# Altium schematic sheet IC right.SchDoc
size A3
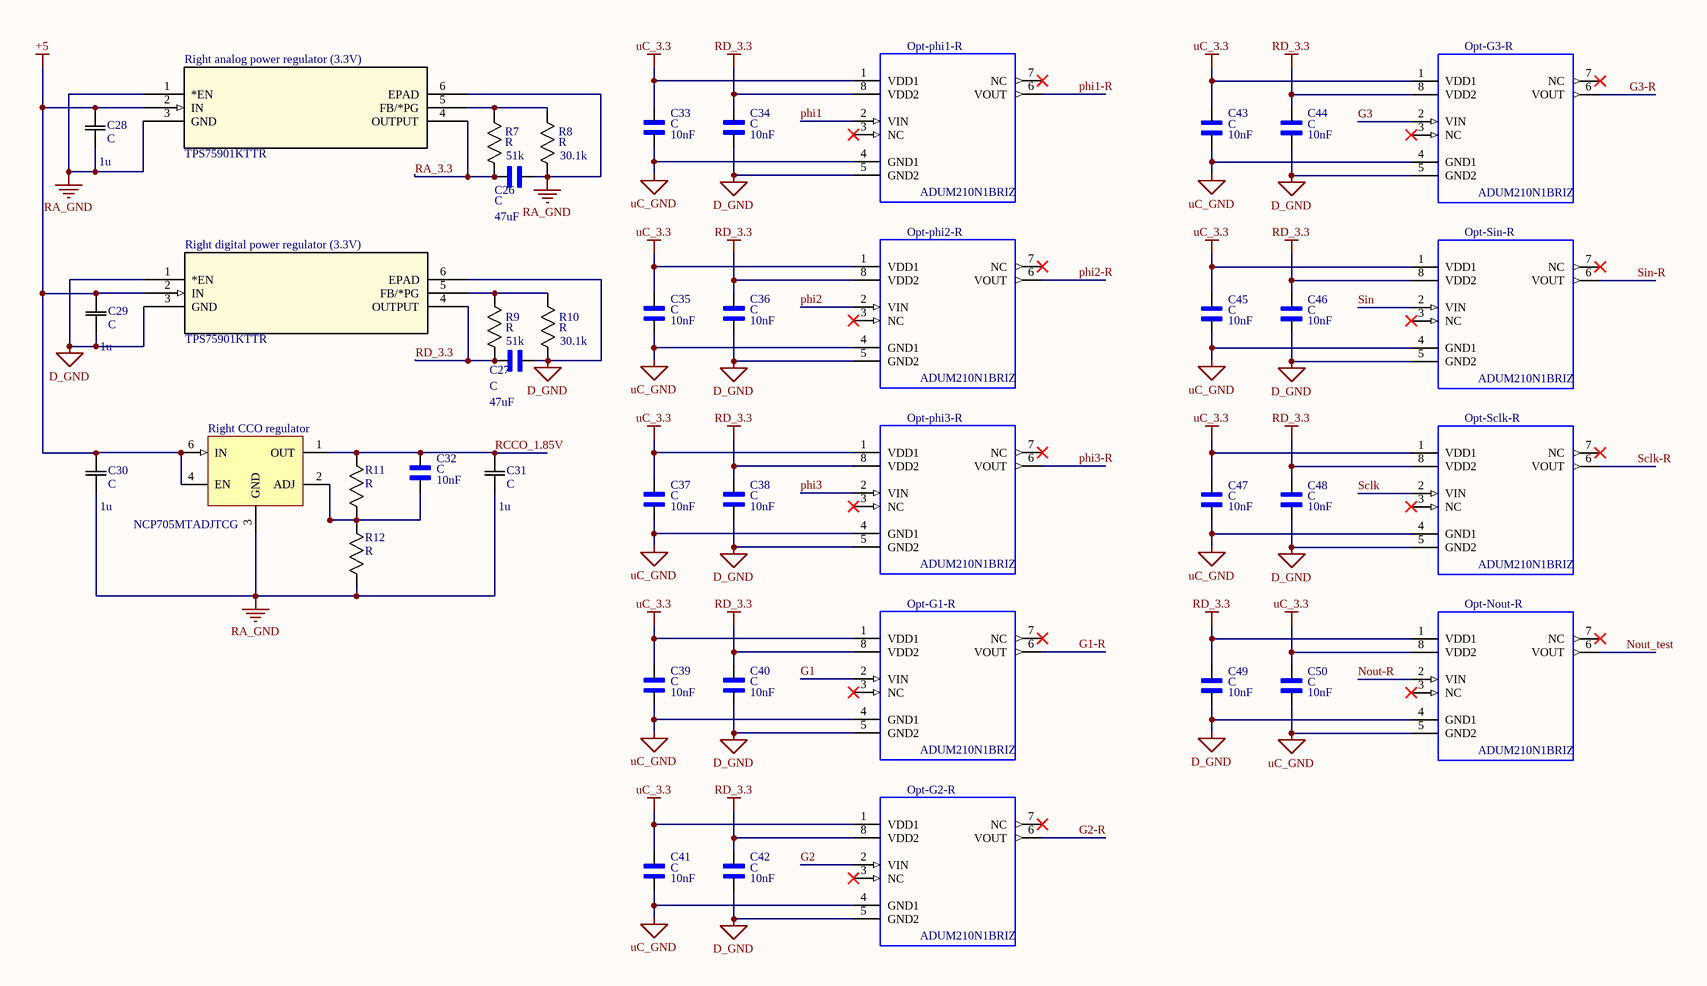
[diagram p0: IC right.SchDoc]

## Parts
C26  C  value 47uF  [CAPC1608X9N]
C27  C  value 47uF  [CAPC1608X9N]
C28  C  value 1u  [CAP_GRM_188]
C29  C  value 1u  [CAP_GRM_188]
C30  C  value 1u  [CAP_GRM_188]
C31  C  value 1u  [CAP_GRM_188]
C32  C  value 10nF  [CAPC1608X9N]
C33  C  value 10nF  [CAPC1608X9N]
C34  C  value 10nF  [CAPC1608X9N]
C35  C  value 10nF  [CAPC1608X9N]
C36  C  value 10nF  [CAPC1608X9N]
C37  C  value 10nF  [CAPC1608X9N]
C38  C  value 10nF  [CAPC1608X9N]
C39  C  value 10nF  [CAPC1608X9N]
C40  C  value 10nF  [CAPC1608X9N]
C41  C  value 10nF  [CAPC1608X9N]
C42  C  value 10nF  [CAPC1608X9N]
C43  C  value 10nF  [CAPC1608X9N]
C44  C  value 10nF  [CAPC1608X9N]
C45  C  value 10nF  [CAPC1608X9N]
C46  C  value 10nF  [CAPC1608X9N]
C47  C  value 10nF  [CAPC1608X9N]
C48  C  value 10nF  [CAPC1608X9N]
C49  C  value 10nF  [CAPC1608X9N]
C50  C  value 10nF  [CAPC1608X9N]
Opt-G1-R  ADUM210N1BRIZ  [SOIC127P1150X330-8N]
Opt-G2-R  ADUM210N1BRIZ  [SOIC127P1150X330-8N]
Opt-G3-R  ADUM210N1BRIZ  [SOIC127P1150X330-8N]
Opt-Nout-R  ADUM210N1BRIZ  [SOIC127P1150X330-8N]
Opt-phi1-R  ADUM210N1BRIZ  [SOIC127P1150X330-8N]
Opt-phi2-R  ADUM210N1BRIZ  [SOIC127P1150X330-8N]
Opt-phi3-R  ADUM210N1BRIZ  [SOIC127P1150X330-8N]
Opt-Sclk-R  ADUM210N1BRIZ  [SOIC127P1150X330-8N]
Opt-Sin-R  ADUM210N1BRIZ  [SOIC127P1150X330-8N]
R7  R  value 51k  [RES_0816]
R8  R  value 30.1k  [RC0603N]
R9  R  value 51k  [RES_0816]
R10  R  value 30.1k  [RC0603N]
R11  R  [RC0603N]
R12  R  [RC0603N]
Right_analog_power_regulator_(3.3V)  TPS75901KTTR  [TO-263-5]
Right_CCO_regulator  NCP705MTADJTCG  [WDFN6]
Right_digital_power_regulator_(3.3V)  TPS75901KTTR  [TO-263-5]

## Nets
+5: C28.2 C29.2 C30.2 Right_analog_power_regulator_(3.3V).2(IN) Right_CCO_regulator.4(EN) Right_CCO_regulator.6(IN) Right_digital_power_regulator_(3.3V).2(IN)
D_GND: C27.1 C29.1 C34.2 C36.2 C38.2 C40.2 C42.2 C44.2 C46.2 C48.2 C49.2 Opt-G1-R.5(GND2) Opt-G2-R.5(GND2) Opt-G3-R.5(GND2) Opt-Nout-R.4(GND1) Opt-phi1-R.5(GND2) Opt-phi2-R.5(GND2) Opt-phi3-R.5(GND2) Opt-Sclk-R.5(GND2) Opt-Sin-R.5(GND2) R10.2 Right_digital_power_regulator_(3.3V).1(*EN) Right_digital_power_regulator_(3.3V).3(GND) Right_digital_power_regulator_(3.3V).6(EPAD)
RA_GND: C26.1 C28.1 C30.1 C31.1 R8.2 R12.2 Right_analog_power_regulator_(3.3V).1(*EN) Right_analog_power_regulator_(3.3V).3(GND) Right_analog_power_regulator_(3.3V).6(EPAD) Right_CCO_regulator.3(GND)
RD_3.3: C27.2 C34.1 C36.1 C38.1 C40.1 C42.1 C44.1 C46.1 C48.1 C49.1 Opt-G1-R.8(VDD2) Opt-G2-R.8(VDD2) Opt-G3-R.8(VDD2) Opt-Nout-R.1(VDD1) Opt-phi1-R.8(VDD2) Opt-phi2-R.8(VDD2) Opt-phi3-R.8(VDD2) Opt-Sclk-R.8(VDD2) Opt-Sin-R.8(VDD2) R9.1 Right_digital_power_regulator_(3.3V).4(OUTPUT)
uC_3.3: C33.1 C35.1 C37.1 C39.1 C41.1 C43.1 C45.1 C47.1 C50.1 Opt-G1-R.1(VDD1) Opt-G2-R.1(VDD1) Opt-G3-R.1(VDD1) Opt-Nout-R.8(VDD2) Opt-phi1-R.1(VDD1) Opt-phi2-R.1(VDD1) Opt-phi3-R.1(VDD1) Opt-Sclk-R.1(VDD1) Opt-Sin-R.1(VDD1)
uC_GND: C33.2 C35.2 C37.2 C39.2 C41.2 C43.2 C45.2 C47.2 C50.2 Opt-G1-R.4(GND1) Opt-G2-R.4(GND1) Opt-G3-R.4(GND1) Opt-Nout-R.5(GND2) Opt-phi1-R.4(GND1) Opt-phi2-R.4(GND1) Opt-phi3-R.4(GND1) Opt-Sclk-R.4(GND1) Opt-Sin-R.4(GND1)
G1: Opt-G1-R.2(VIN)
G1-R: Opt-G1-R.6(VOUT)
G2: Opt-G2-R.2(VIN)
G2-R: Opt-G2-R.6(VOUT)
G3: Opt-G3-R.2(VIN)
G3-R: Opt-G3-R.6(VOUT)
Nout-R: Opt-Nout-R.2(VIN)
Nout_test: Opt-Nout-R.6(VOUT)
phi1: Opt-phi1-R.2(VIN)
phi1-R: Opt-phi1-R.6(VOUT)
phi2: Opt-phi2-R.2(VIN)
phi2-R: Opt-phi2-R.6(VOUT)
phi3: Opt-phi3-R.2(VIN)
phi3-R: Opt-phi3-R.6(VOUT)
RA_3.3: C26.2 R7.1 Right_analog_power_regulator_(3.3V).4(OUTPUT)
RCCO_1.85V: C31.2 C32.1 R11.1 Right_CCO_regulator.1(OUT)
Sclk: Opt-Sclk-R.2(VIN)
Sclk-R: Opt-Sclk-R.6(VOUT)
Sin: Opt-Sin-R.2(VIN)
Sin-R: Opt-Sin-R.6(VOUT)
NetC32_2: C32.2 R11.2 R12.1 Right_CCO_regulator.2(ADJ)
NetR7_2: R7.2 R8.1 Right_analog_power_regulator_(3.3V).5(FB/*PG)
NetR9_2: R9.2 R10.1 Right_digital_power_regulator_(3.3V).5(FB/*PG)

Not connected (* = marked no-connect by the designer): Opt-G1-R 3(NC)* 7(NC)*; Opt-G2-R 3(NC)* 7(NC)*; Opt-G3-R 3(NC)* 7(NC)*; Opt-Nout-R 3(NC)* 7(NC)*; Opt-phi1-R 3(NC)* 7(NC)*; Opt-phi2-R 3(NC)* 7(NC)*; Opt-phi3-R 3(NC)* 7(NC)*; Opt-Sclk-R 3(NC)* 7(NC)*; Opt-Sin-R 3(NC)* 7(NC)*

## Library data of the parts
C26 C27 = GRM188R60G476ME15D: Multilayer Ceramic Capacitors - 47uF 4V X5R 20% Pad SMD 0603 85C T/R; MF: Murata; Digi-Key_Part_Number: 490-13246-1-ND; SnapEDA_Link: https://www.snapeda.com/parts/GRM188R60G476ME15D/Murata%2520Electronics%2520North%2520America/view-part/?ref=snap; Package: 0603 Murata; Digi-Key_Purchase_URL: https://www.digikey.ca/product-detail/en/murata-electronics-north-america/GRM188R60G476ME15D/490-13246-1-ND/5877454?utm_source=snapeda&utm_medium=aggregator&utm_campaign=symbol; Manufacturer Part Number: GRM188R60G476ME15D
C28-C31 = GRM188R60J105KA0: Imported; Manufacturer Part Number: GRM188R60J105KA01D; Vendor: Murata; Built_By: EMA_UL_Team; Type: DEV; C: Copyright (C) 2015 Accelerated Designs. All rights reserved; RefDes: RefDes
C32-C50 = GRM1885C1H103JA01D: Multilayer Ceramic Capacitor, GRM Series, 0.01 F, 5%, C0G / NP0, 50 V, 0603 [1608 Metric]; MF: Murata; Package: 0603 Murata; Digi-Key_Purchase_URL: https://www.digikey.ca/product-detail/en/murata-electronics-north-america/GRM1885C1H103JA01D/490-9666-1-ND/4934772?utm_source=snapeda&utm_medium=aggregator&utm_campaign=symbol; Digi-Key_Part_Number: 490-9666-1-ND; SnapEDA_Link: https://www.snapeda.com/parts/GRM1885C1H103JA01D/Murata%20Electronics%20North%20America/view-part/?ref=snap; Manufacturer Part Number: GRM1885C1H103JA01D
Opt-G1-R Opt-G2-R Opt-G3-R Opt-Nout-R Opt-phi1-R Opt-phi2-R Opt-phi3-R Opt-Sclk-R Opt-Sin-R = ADUM210N1BRIZ: Digital isolator 1-CH 8-Pin SOIC T/R; MF: Analog Devices; Digi-Key_Purchase_URL: https://www.digikey.ca/product-detail/en/analog-devices-inc/ADUM210N1BRIZ/ADUM210N1BRIZ-ND/6072296; Package: SOIC8; Digi-Key_Part_Number: ADUM210N1BRIZ-ND; SnapEDA_Link: https://www.snapeda.com/parts/ACPL-072L-500E/Broadcom/view-part/?ref=snap; Value: *; Manufacturer Part Number: ADUM210N1BRIZ
R7 R9 = RR0816P-513-D: Imported; Vendor: Susumu; Built_By: EMA_UL_Team; C: Copyright (C) 2015 Accelerated Designs. All rights reserved; RefDes: RefDes; Type: DEV; Manufacturer Part Number: RR0816P-513-D
R8 R10 = RT0603BRD0730K1L: Imported; Vendor: Yageo; Built_By: EMA_UL_Team; C: Copyright (C) 2015 Accelerated Designs. All rights reserved; RefDes: RefDes; Type: DEV; Manufacturer Part Number: RT0603BRD0730K1L
R11 = RC0603FR-07130KL: Imported; Vendor: Yageo; Built_By: EMA_UL_Team; Value: 130k; C: Copyright (C) 2015 Accelerated Designs. All rights reserved; RefDes: RefDes; Type: DEV; Manufacturer Part Number: RC0603FR-07130KL
R12 = ERJ-3GEY0R00V: Imported; Vendor: Panasonic; Built_By: EMA_UL_Team; Value: 98.8k; C: Copyright (C) 2015 Accelerated Designs. All rights reserved; RefDes: RefDes; Type: DEV; Manufacturer Part Number: ERJ-3GEY0R00V
Right_analog_power_regulator_(3.3V) Right_digital_power_regulator_(3.3V) = TPS75901KTTR: Imported; Vendor: Texas Instruments; Built_By: EMA_UL_Team; C: Copyright (C) 2015 Accelerated Designs. All rights reserved; Manufacturer: Texas Instruments; RefDes: RefDes; Type: DEV; Value: Value; Manufacturer Part Number: TPS75901KTTR
Right_CCO_regulator = NCP705MTADJTCG: 500 mA, Ultra-Low  Quiescent Current, IQ 13 A,  Ultra-Low Noise, LDO  Voltage Regulator; Manufacturer: ON Semiconductor; Manufacturer Part Number: NCP705MTADJTCG; Digi-Key link: https://www.digikey.ca/product-detail/en/on-semiconductor/NCP705MTADJTCG/NCP705MTADJTCGOSCT-ND/8538627